# EAGLE design CPS2 CN2 Adapter V1_1 (EAGLE 7.7.0)
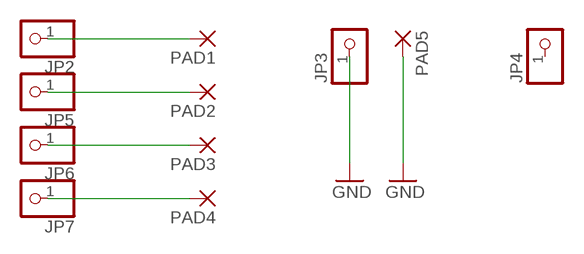
[diagram p0: schematic, sheet 1]

## Parts
JP2  PINHD-1X1  [1X01]
JP3  PINHD-1X1  [1X01]
JP4  PINHD-1X1  [1X01]
JP5  PINHD-1X1  [1X01]
JP6  PINHD-1X1  [1X01]
JP7  PINHD-1X1  [1X01]
PAD1  SMD2  [SMD1,27-2,54]
PAD2  SMD2  [SMD1,27-2,54]
PAD3  SMD2  [SMD1,27-2,54]
PAD4  SMD2  [SMD1,27-2,54]
PAD5  SMD2  [SMD1,27-2,54]

## Nets
GND: JP3.1 PAD5.1(P)
N$2: JP2.1 PAD1.1(P)
N$3: JP5.1 PAD2.1(P)
N$4: JP6.1 PAD3.1(P)
N$5: JP7.1 PAD4.1(P)
Unconnected: JP4.1

## Library data of the parts
JP2-JP7 = pinhead:PINHD-1X1: PIN HEADER
PAD1-PAD5 = wirepad:SMD2: SMD PAD

## Board
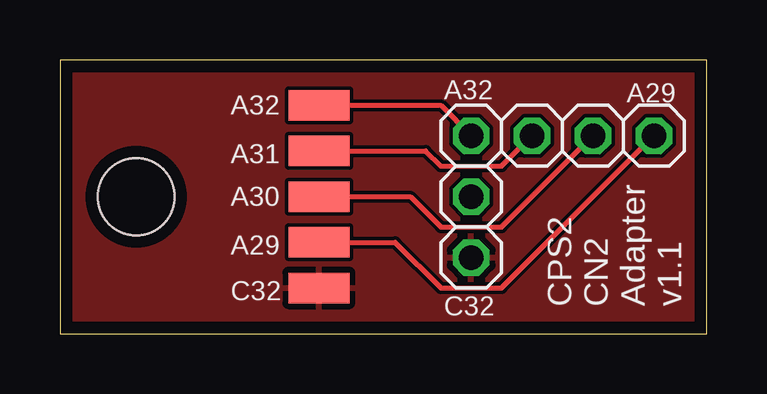
[diagram p1: board, top side]
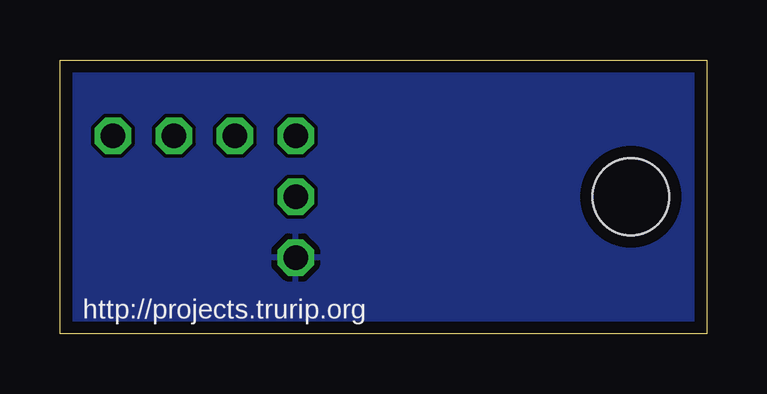
[diagram p2: board, bottom side, seen from below]

Size 26.98 x 11.42 mm. Coordinates in mm from the lower left corner, seen from the top.
Outline: 0,0 26.98,0 26.98,11.42 0,11.42 0,0
Copper layers (1*16): Top 0.035mm / dielectric 1.6mm / Bottom 0.035mm
Design rules "Elecrow_2-layer_PCB_eagle_rule": minimum track width 6mil, minimum drill 12mil, track to track 6mil, track to pad 6mil, pad to pad 6mil, via to via 8mil, smd to smd 0mil, copper to edge 20mil, drill to drill 10mil, minimum pad ring 6mil, minimum via ring 6mil, stop-mask expansion 0mil, vias tented up to drill 100mil, thermal gap 10mil
Holes 3.2 mm at 3.17,5.71

### Footprints (pad centres in the part's own frame; a part is rotated, then mirrored left to right if it is on the bottom)
1X01 = drill 1.016 octagon: 1 0,0
SMD1,27-2,54 = smd 1.27 x 2.54: 1 0,0

### Placement (x,y rotation side)
JP2  24.77,8.26 0 top
JP3  17.15,3.17 0 top
JP4  17.15,5.71 0 top
JP5  22.23,8.26 0 top
JP6  19.69,8.26 0 top
JP7  17.15,8.26 0 top
PAD1  10.79,3.81 90 top
PAD2  10.79,5.71 90 top
PAD3  10.79,7.62 90 top
PAD4  10.79,9.53 90 top
PAD5  10.79,1.91 90 top

### Tracks (layer width: path | path; a pad name or v marks a point on that pad's centre or on a via)
GND
  pour Bottom: -1.91,13.33 29.85,13.33 29.85,-1.91 -1.91,-1.91
  pour Top: -0.64,12.06 28.58,12.06 28.58,-0.64 -0.64,-0.64
N$2
  Top 0.203: PAD1.1 13.97,3.81 15.88,1.91 18.42,1.91 JP2.1
N$3
  Top 0.203: PAD2.1 14.61,5.71 15.88,4.45 18.42,4.45 JP5.1
N$4
  Top 0.203: PAD3.1 15.24,7.62 15.88,6.98 18.42,6.98 JP6.1
N$5
  Top 0.203: PAD4.1 15.88,9.53 JP7.1

### Text on the board
tNames: A32 | A32 | A29 | A31 | A30 | A29 | C32 | CPS2 / CN2 / Adapter / v1.1 | C32
bNames: http://projects.trurip.org